# Altium schematic sheet misc.SchDoc
size 381 x 241 mm; SheetNumber: 1; SheetTotal: 2
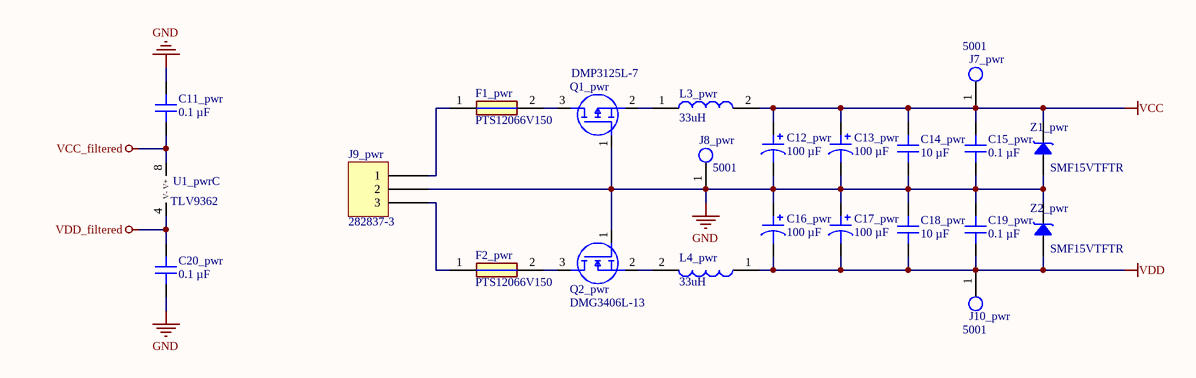
[diagram p0: misc.SchDoc]

## Parts
C11_pwr  0.1 µF  [CAP 1206_3216 - 0.8MM]
C12_pwr  100 µF  [CAP ALSMD 8.3MM H10.5MM]
C13_pwr  100 µF  [CAP ALSMD 8.3MM H10.5MM]
C14_pwr  10 µF  [CAP 1206_3216 - 0.8MM]
C15_pwr  0.1 µF  [CAP 1206_3216 - 0.8MM]
C16_pwr  100 µF  [CAP ALSMD 8.3MM H10.5MM]
C17_pwr  100 µF  [CAP ALSMD 8.3MM H10.5MM]
C18_pwr  10 µF  [CAP 1206_3216 - 0.8MM]
C19_pwr  0.1 µF  [CAP 1206_3216 - 0.8MM]
C20_pwr  0.1 µF  [CAP 1206_3216 - 0.8MM]
F1_pwr  PTS12066V150  [FUSC3216X90N]
F2_pwr  PTS12066V150  [FUSC3216X90N]
J7_pwr  5001  [FP-5001-MFG]
J8_pwr  5001  [FP-5001-MFG]
J9_pwr  282837-3  [TE 282837-3]
J10_pwr  5001  [FP-5001-MFG]
L3_pwr  33uH  [INDPM116102X400N]
L4_pwr  33uH  [INDPM116102X400N]
Q1_pwr  DMP3125L-7  [SOT96P240X110-3N]
Q2_pwr  DMG3406L-13  [SOT96P240X110-3N]
U1_pwr  TLV9362  [SOIC8-127P600X175-8N]  (part C of 3)
Z1_pwr  SMF15VTFTR  [SMF15VTFTR]
Z2_pwr  SMF15VTFTR  [SMF15VTFTR]

## Nets
GND: C11_pwr.2 C12_pwr.2 C13_pwr.2 C14_pwr.1 C15_pwr.1 C16_pwr.1 C17_pwr.1 C18_pwr.2 C19_pwr.2 C20_pwr.1 J8_pwr.1 J9_pwr.2 Q1_pwr.1(G) Q2_pwr.1(G) Z1_pwr.2 Z2_pwr.1
VCC: C12_pwr.1 C13_pwr.1 C14_pwr.2 C15_pwr.2 J7_pwr.1 L3_pwr.2 Z1_pwr.1
VCC_filtered: C11_pwr.1 U1_pwr.8(V+)
VDD: C16_pwr.2 C17_pwr.2 C18_pwr.1 C19_pwr.1 J10_pwr.1 L4_pwr.1 Z2_pwr.2
VDD_filtered: C20_pwr.2 U1_pwr.4(V-)
NetF1_pwr_1: F1_pwr.1 J9_pwr.1
NetF1_pwr_2: F1_pwr.2 Q1_pwr.3(D)
NetF2_pwr_1: F2_pwr.1 J9_pwr.3
NetF2_pwr_2: F2_pwr.2 Q2_pwr.3(D)
NetL3_pwr_1: L3_pwr.1 Q1_pwr.2(S)
NetL4_pwr_2: L4_pwr.2 Q2_pwr.2(S)

## Library data of the parts
C11_pwr C15_pwr C19_pwr C20_pwr = 885012208087: CAP CER 0.1UF 50V X7R 1206; manufacturer: Würth Elektronik; Tolerance: ±10%; Part Number: 885012208087; Capacitance: 0.1 µF; Applications: General Purpose; componentlink1description: Datasheet; componentlink1url: https://katalog.we-online.de/pbs/datasheet/885012208087.pdf; componentlink2description: DigiKey Link; componentlink2url: https://www.digikey.com/en/products/detail/würth-elektronik/885012208087/5453982; Device Package: 1206 (3216 Metric); lastupdated: 6/4/2024 19:10:27; Lifecycle Status: Active; Minimum Order: 1; Mounting Type: Surface Mount, MLCC; Operating Temperature: -55°C ~ 125°C; Package / Case: 1206 (3216 Metric); packaging: TapeAndReel; partid: 20879; Part Status: Active; price: 0.06; series: WCAP-CSGP; Size / Dimension: 0.126" L x 0.063" W (3.20mm x 1.60mm); Supplier 1: DigiKey; Supplier Part Number 1: 732-8127-1-ND; Temperature Coefficient: X7R; Thickness (Max): 0.035" (0.90mm); value: 0.1 µF; Voltage - Rated: 50V
C12_pwr C13_pwr C16_pwr C17_pwr = 50TZV100M8X10.5: CAP ALUM 100UF 20% 50V SMD; manufacturer: Rubycon; Impedance: 340 mOhms; Lifetime @ Temp.: 2000 Hrs @ 105°C; Polarization: Polar; Ripple Current @ High Frequency: 350 mA @ 100 kHz; Ripple Current @ Low Frequency: 175 mA @ 120 Hz; Surface Mount Land Size: 0.327" L x 0.327" W (8.30mm x 8.30mm); Part Number: 50TZV100M8X10.5; Applications: Automotive; Capacitance: 100 µF; componentlink1description: Datasheet; componentlink1url: http://www.rubycon.co.jp/en/catalog/e_pdfs/aluminum/e_tzv.pdf; componentlink2description: DigiKey Link; componentlink2url: https://www.digikey.com/en/products/detail/rubycon/50TZV100M8X10-5/3134931; Device Package: Radial, Can - SMD; Height - Seated (Max): 0.413" (10.50mm); lastupdated: 6/3/2024 20:15:48; Lifecycle Status: Active; Minimum Order: 1; Mounting Type: Surface Mount; Operating Temperature: -55°C ~ 105°C; Package / Case: Radial, Can - SMD; packaging: TapeAndReel; partid: 7533; Part Status: Active; price: 0.16; Ratings: AEC-Q200; series: TZV; Size / Dimension: 0.315" Dia (8.00mm); Supplier 1: DigiKey; Supplier Part Number 1: 1189-1651-1-ND; Tolerance: ±20%; value: 100 µF; Voltage - Rated: 50 V
C14_pwr C18_pwr = 885012208069: CAP CER 10UF 25V X7R 1206; manufacturer: Würth Elektronik; Tolerance: ±10%; Part Number: 885012208069; Capacitance: 10 µF; Applications: General Purpose; componentlink1description: Datasheet; componentlink1url: https://katalog.we-online.de/pbs/datasheet/885012208069.pdf; componentlink2description: DigiKey Link; componentlink2url: https://www.digikey.com/en/products/detail/würth-elektronik/885012208069/5453429; Device Package: 1206 (3216 Metric); lastupdated: 6/4/2024 19:10:32; Lifecycle Status: Active; Minimum Order: 1; Mounting Type: Surface Mount, MLCC; Operating Temperature: -55°C ~ 125°C; Package / Case: 1206 (3216 Metric); packaging: TapeAndReel; partid: 43199; Part Status: Active; price: 0.40; series: WCAP-CSGP; Size / Dimension: 0.126" L x 0.063" W (3.20mm x 1.60mm); Supplier 1: DigiKey; Supplier Part Number 1: 732-7574-1-ND; Temperature Coefficient: X7R; Thickness (Max): 0.075" (1.90mm); value: 10 µF; Voltage - Rated: 25V
F1_pwr F2_pwr = PTS12066V150: Fuse; Manufacturer_Name: Eaton; Datasheet Link: https://in.element14.com/eaton-bussmann-series/pts120660v005/pptc-resettable-fuse-0-05a-60vdc/dp/2929344?srsltid=AfmBOorX1B25_1GKuczfUlW7ilxwoZgl3KmxHJmMFzJpoWYAJ50DmC3S; Height: 0.9mm; Manufacturer_Part_Number: PTS12066V150; Mouser Part Number: 504-PTS12066V150; Mouser Price/Stock: https://www.mouser.co.uk/ProductDetail/Eaton-Electronics/PTS120660V005?qs=QmibqUXyDhQPirhmCJ6OpQ%3D%3D; Arrow Part Number: PTS120660V005; Arrow Price/Stock: https://www.arrow.com/en/products/pts120660v005/eaton?region=europe
J7_pwr J8_pwr J10_pwr = CMP-2000-05181-2: PC TEST POINT MINIATURE BLACK; Body Material: Bronze; Plating: Silver; Inside Diameter: 1.27mm; Hole Diameter: 1.6mm; Number of Ports: 1; Outside Diameter: 2.54mm; Insulation: Insulated; Insulation Material: Nylon; Mount: Through Hole; RoHS Compliant: Yes; Series: THM; Height: 0.3inch; Termination: Through Hole; Material: Nylon; Packaging: Bulk; Contact Material: Bronze; REACH SVHC: No SVHC; Contact Plating: Silver; Orientation: Straight; Lead Free: Lead Free; Package Quantity: 100; Length: 7.62mm; Flammability Rating: UL94 V-0; Number of Contacts: 1; Diameter: 2.54mm; Housing Color: Black; Color: Black
J9_pwr = 282837-3: TERM BLK 3P SIDE ENT 5.08MM PCB; Manufacturer: TE Connectivity AMP Connectors; Current: 13.5 A; Mating Orientation: Horizontal with Board; Number of Levels: 1; Pitch: 0.200" (5.08mm); Positions Per Level: 3; Voltage: 300 V; Wire Gauge: 16-28 AWG; Wire Termination: Screw - Rising Cage Clamp; Part Number: 282837-3; Color: Green; ComponentLink1Description: Datasheet; ComponentLink1URL: https://www.te.com/commerce/DocumentDelivery/DDEController?Action=srchrtrv&DocNm=282837&DocType=Customer+Drawing&DocLang=English; ComponentLink2Description: DigiKey Link; ComponentLink2URL: https://www.digikey.com/en/products/detail/te-connectivity-amp-connectors/282837-3/2187974; Features: Interlocking (Side); LastUpdated: 6/21/2022 15:00:39; Lifecycle Status: Active; Minimum Order: 1; Mounting Type: Through Hole; Packaging: Tray; Part Status: Active; Price: 0.47; Series: Buchanan; Supplier 1: DigiKey; Supplier Part Number 1: A113321-ND
L3_pwr L4_pwr = AMRM00101040330MA1: Inductor; Manufacturer_Name: Pulse Electronics; Datasheet Link: https://productfinder.pulseelectronics.com/api/open/part-attachments/datasheet/amrm00101040330ma1; Height: 4mm; Manufacturer_Part_Number: AMRM00101040330MA1; Mouser Part Number: 673-AMRM101040330MA1; Mouser Price/Stock: https://www.mouser.co.uk/ProductDetail/Pulse-Electronics/AMRM00101040330MA1?qs=HoCaDK9Nz5eI6M5ad0CXDA%3D%3D; Value: 33uH
Q1_pwr = DMP3125L-7: MOSFET (P-Channel); Manufacturer_Name: Diodes Incorporated; Datasheet Link: https://www.diodes.com//assets/Datasheets/DMP3125L.pdf; Height: 1.1mm; Manufacturer_Part_Number: DMP3125L-7; Mouser Part Number: 621-DMP3125L-7; Mouser Price/Stock: https://www.mouser.co.uk/ProductDetail/Diodes-Incorporated/DMP3125L-7?qs=W0yvOO0ixfH8ma8MdHfXQA%3D%3D; Arrow Part Number: DMP3125L-7; Arrow Price/Stock: https://www.arrow.com/en/products/dmp3125l-7/diodes-incorporated?region=nac
Q2_pwr = DMG3406L-13: MOSFET (N-Channel); Manufacturer_Name: Diodes Incorporated; Datasheet Link: https://www.diodes.com//assets/Datasheets/DMG3406L.pdf; Height: 1.1mm; Manufacturer_Part_Number: DMG3406L-13; Mouser Part Number: 621-DMG3406L-13; Mouser Price/Stock: https://www.mouser.co.uk/ProductDetail/Diodes-Incorporated/DMG3406L-13?qs=BvpHGKeVh3r%252BRZTTCOfjpg%3D%3D; Arrow Part Number: DMG3406L-13; Arrow Price/Stock: https://www.arrow.com/en/products/dmg3406l-13/diodes-incorporated?region=nac
U1_pwr = TLV9362: TLV936x 10-MHz, 40-V, RRO, Operational Amplifie; ComponentLink1Description: Datasheet; ComponentLink1URL: https://www.ti.com/lit/ds/symlink/tlv9362.pdf
Z1_pwr Z2_pwr = SMF15VTFTR: Zener Diode; Manufacturer_Name: ROHM Semiconductor; Datasheet Link: https://fscdn.rohm.com/en/products/databook/datasheet/discrete/diode/zener/smf15vtftr-e.pdf; Height: 0.9mm; Manufacturer_Part_Number: SMF15VTFTR; Mouser Part Number: 755-SMF15VTFTR; Mouser Price/Stock: https://www.mouser.co.uk/ProductDetail/ROHM-Semiconductor/SMF15VTFTR?qs=HXFqYaX1Q2wU8NS9uLe0xg%3D%3D